# Altium schematic sheet 10_PDM_MICS.SchDoc: PDM FPC Connector
size B; DocumentNumber: 6; SheetNumber: 6; SheetTotal: 12
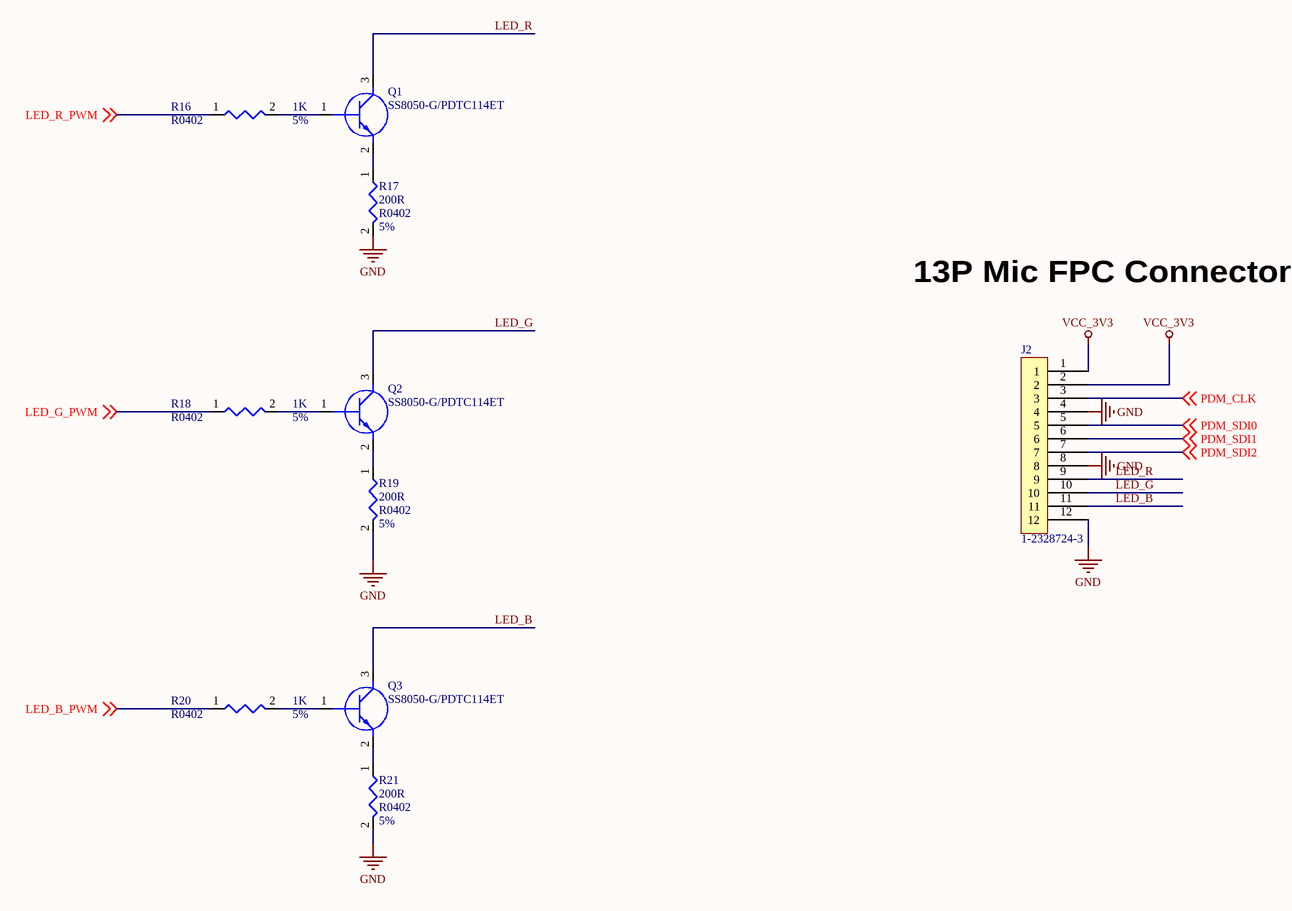
[diagram p0: 10_PDM_MICS.SchDoc]

## Parts
J2  1-2328724-3  [123287243]
Q1  SS8050-G/PDTC114ET  [SOT23]
Q2  SS8050-G/PDTC114ET  [SOT23]
Q3  SS8050-G/PDTC114ET  [SOT23]
R16  1K  Tolerance: 5%  [R0402]
R17  200R  Tolerance: 5%  [R0402]
R18  1K  Tolerance: 5%  [R0402]
R19  200R  Tolerance: 5%  [R0402]
R20  1K  Tolerance: 5%  [R0402]
R21  200R  Tolerance: 5%  [R0402]

## Nets
GND: J2.4 J2.8 J2.12 R17.2 R19.2 R21.2
VCC_3V3: J2.1 J2.2
LED_B: J2.11 Q3.3(C)
LED_B_PWM: R20.1 ; off-sheet LED_B_PWM
LED_G: J2.10 Q2.3(C)
LED_G_PWM: R18.1 ; off-sheet LED_G_PWM
LED_R: J2.9 Q1.3(C)
LED_R_PWM: R16.1 ; off-sheet LED_R_PWM
PDM_CLK: J2.3 ; off-sheet PDM_CLK
PDM_SDI0: J2.5 ; off-sheet PDM_SDI0
PDM_SDI1: J2.6 ; off-sheet PDM_SDI1
PDM_SDI2: J2.7 ; off-sheet PDM_SDI2
NetQ1_1: Q1.1(B) R16.2
NetQ1_2: Q1.2(E) R17.1
NetQ2_1: Q2.1(B) R18.2
NetQ2_2: Q2.2(E) R19.1
NetQ3_1: Q3.1(B) R20.2
NetQ3_2: Q3.2(E) R21.1

## Notes on the sheet
- 13P Mic FPC Connector
- Title
- Size:
- Date:
- B
- Number:
- Time:
- Revision:
- Sheet
- of
- Author: Edward Lai
- Email: edward@vibe.us
- Vibe Inc
- Hangzhou
- vibe.us <http://vibe.us>
- File:

## Library data of the parts
J2 = 12pP254: FFC & FPC连接器 13 PIN FPC CONNECTOR 0.3mmP FRONT FLIP
Q1-Q3 = SS8050-G: Transistor BJT NPN; Manufacturer_Name: Comchip Technology; Datasheet Link: https://componentsearchengine.com//SS8050-G.pdf; Height: 1.15mm; Mouser2 Part Number: 750-SS8050-G; Mouser2 Price/Stock: https://www.mouser.com/Search/Refine.aspx?Keyword=750-SS8050-G; Manufacturer_Part_Number: SS8050-G
R16 R18 R20 = RESISTOR: 通用厚膜电阻,1K,+/-5%,R0405; Priority: A; PCB Footprint: R0402; Part Type: 通用厚膜电阻
R17 R19 R21 = RESISTOR: 通用厚膜电阻,200R,+/-5%,R0402; Priority: A; PCB Footprint: R0402; Part Type: 通用厚膜电阻